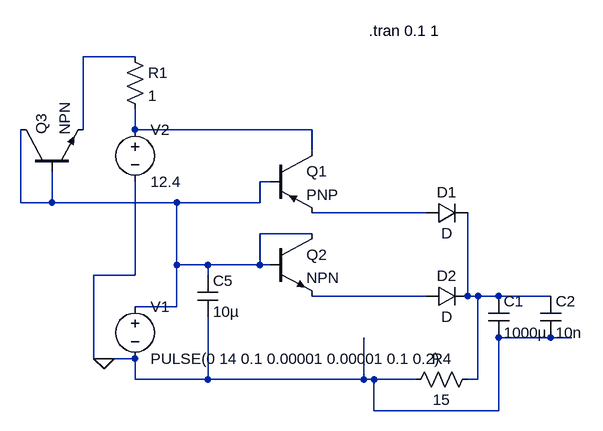
[diagram p0: schematic BatterySwitch.asc]
BatterySwitch.asc, the LTspice schematic file:
Version 4
SHEET 1 1028 680
WIRE 224 80 144 80
WIRE 144 192 144 80
WIRE 224 192 224 160
WIRE 496 192 224 192
WIRE 496 224 496 192
WIRE 432 272 416 272
WIRE 48 304 48 192
WIRE 96 304 96 256
WIRE 96 304 48 304
WIRE 288 304 96 304
WIRE 416 304 416 272
WIRE 416 304 288 304
WIRE 672 320 496 320
WIRE 496 352 416 352
WIRE 288 400 288 304
WIRE 336 400 288 400
WIRE 416 400 416 352
WIRE 416 400 336 400
WIRE 432 400 416 400
WIRE 224 416 224 272
WIRE 224 416 160 416
WIRE 336 416 336 400
WIRE 672 448 496 448
WIRE 736 448 736 320
WIRE 752 448 736 448
WIRE 784 448 752 448
WIRE 864 448 784 448
WIRE 288 464 288 400
WIRE 288 464 224 464
WIRE 864 512 784 512
WIRE 896 512 864 512
WIRE 160 544 160 416
WIRE 176 544 160 544
WIRE 224 544 176 544
WIRE 224 576 224 544
WIRE 336 576 336 480
WIRE 336 576 224 576
WIRE 576 576 576 512
WIRE 576 576 336 576
WIRE 592 576 576 576
WIRE 656 576 592 576
WIRE 752 576 752 448
WIRE 752 576 736 576
WIRE 592 624 592 576
WIRE 784 624 784 512
WIRE 784 624 592 624
FLAG 176 544 0
SYMBOL voltage 224 448 R0
SYMATTR InstName V1
SYMATTR Value PULSE(0 14 0.1 0.00001 0.00001 0.1 0.2)
SYMBOL voltage 224 176 R0
SYMATTR InstName V2
SYMATTR Value 12.4
SYMBOL diode 672 464 R270
WINDOW 0 32 32 VTop 2
WINDOW 3 0 32 VBottom 2
SYMATTR InstName D2
SYMBOL res 752 560 R90
WINDOW 0 0 56 VBottom 2
WINDOW 3 32 56 VTop 2
SYMATTR InstName R4
SYMATTR Value 15
SYMBOL pnp 432 224 R0
SYMATTR InstName Q1
SYMBOL cap 768 448 R0
SYMATTR InstName C1
SYMATTR Value 1000µ
SYMBOL npn 432 352 R0
SYMATTR InstName Q2
SYMBOL diode 672 336 R270
WINDOW 0 32 32 VTop 2
WINDOW 3 0 32 VBottom 2
SYMATTR InstName D1
SYMBOL cap 848 448 R0
SYMATTR InstName C2
SYMATTR Value 10n
SYMBOL cap 320 416 R0
SYMATTR InstName C5
SYMATTR Value 10µ
SYMBOL npn 48 256 R270
SYMATTR InstName Q3
SYMBOL res 208 64 R0
SYMATTR InstName R1
SYMATTR Value 1
TEXT 584 40 Left 2 !.tran 0.1 1

The netlist it stands for:
* BatterySwitch.asc
V1 N003 0 PULSE(0 14 0.1 0.00001 0.00001 0.1 0.2)
V2 N002 0 12.4
D2 N005 N006 D
R4 N006 0 15
Q1 N002 N003 N004 0 PNP
C1 N006 0 1000µ
Q2 N003 N003 N005 0 NPN
D1 N004 N006 D
C2 N006 0 10n
C5 N003 0 10µ
Q3 N003 N003 N001 0 NPN
R1 N001 N002 1
.model D D
.lib standard.dio
.model NPN NPN
.model PNP PNP
.lib standard.bjt
.tran 0.1 1
.backanno
.end